# Altium schematic sheet MCU.SchDoc: =ProjectName
size A4; CheckedBy: DatNB; Author: Ven; CompanyName: Nacentech; Organization: IMET
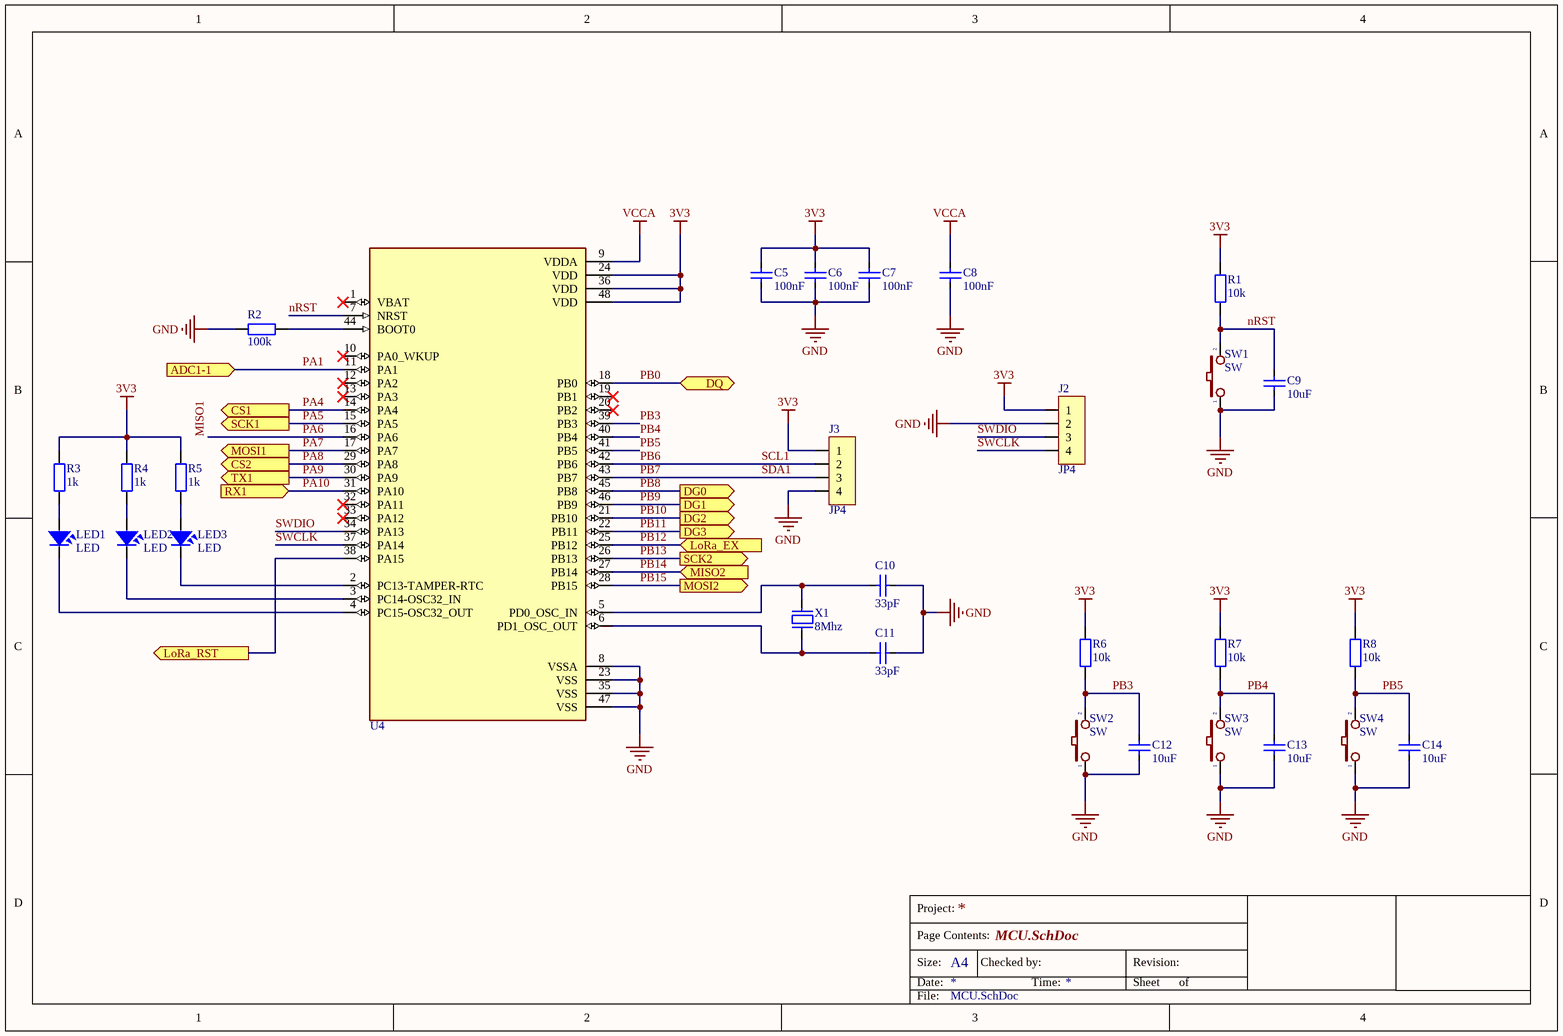
[diagram p0: MCU.SchDoc]

## Parts
C5  100nF  [CAP_0805]
C6  100nF  [CAP_0805]
C7  100nF  [CAP_0805]
C8  100nF  [CAP_0805]
C9  10uF  [CAP_0805]
C10  33pF  [CAP_0805]
C11  33pF  [CAP_0805]
C12  10uF  [CAP_0805]
C13  10uF  [CAP_0805]
C14  10uF  [CAP_0805]
J2  JP4  [JP4-C1T]
J3  JP4  [JP4-C1T]
LED1  LED  [LED-0805-Red]
LED2  LED  [LED-0805-Yellow]
LED3  LED  [LED-0805-Green]
R1  10k  [RES-SMD-0805]
R2  100k  [RES-SMD-0805]
R3  1k  [RES-SMD-0805]
R4  1k  [RES-SMD-0805]
R5  1k  [RES-SMD-0805]
R6  10k  [RES-SMD-0805]
R7  10k  [RES-SMD-0805]
R8  10k  [RES-SMD-0805]
SW1  SW  [SW 3x2x4]
SW2  SW  [SW2]
SW3  SW  [SW2]
SW4  SW  [SW2]
U4  STM32  [LQFP 48]  (value not drawn)
X1  8Mhz  [XTAL 5032 SMD]

## Ports
ADC1-1 (in), CS1 (out), CS2 (out), DG0 (out), DG1 (out), DG2 (out), DG3 (out), DQ (bidir), LoRa_EX (in), LoRa_RST (out), MISO2 (in), MOSI1 (out), MOSI2 (out), RX1 (in), SCK1 (out), SCK2 (out), TX1 (out)

## Nets
3V3: C5.2 C6.2 C7.2 J2.1 J3.1 R1.1 R3.1 R4.1 R5.1 R6.1 R7.1 R8.1 U4.24(VDD) U4.36(VDD) U4.48(VDD)
GND: C5.1 C6.1 C7.1 C8.1 C9.1 C10.2 C11.2 C12.1 C13.1 C14.1 J2.2 J3.4 R2.1 SW1.1 SW2.1 SW3.1 SW4.1 U4.8(VSSA) U4.23(VSS) U4.35(VSS) U4.47(VSS)
VCCA: C8.2 U4.9(VDDA)
LoRa_RST: U4.38(PA15) ; port LoRa_RST
MISO1: U4.16(PA6)  [also labelled PA6]
nRST: C9.2 R1.2 SW1.2 U4.7(NRST)
PA1: U4.11(PA1) ; port ADC1-1
PA4: U4.14(PA4) ; port CS1
PA5: U4.15(PA5) ; port SCK1
PA7: U4.17(PA7) ; port MOSI1
PA8: U4.29(PA8) ; port CS2
PA9: U4.30(PA9) ; port TX1
PA10: U4.31(PA10) ; port RX1
PB0: U4.18(PB0) ; port DQ
PB3: C12.2 R6.2 SW2.2 U4.39(PB3)
PB4: C13.2 R7.2 SW3.2 U4.40(PB4)
PB5: C14.2 R8.2 SW4.2 U4.41(PB5)
PB6: J3.2 U4.42(PB6)  [also labelled SCL1]
PB7: J3.3 U4.43(PB7)  [also labelled SDA1]
PB8: U4.45(PB8) ; port DG0
PB9: U4.46(PB9) ; port DG1
PB10: U4.21(PB10) ; port DG2
PB11: U4.22(PB11) ; port DG3
PB12: U4.25(PB12) ; port LoRa_EX
PB13: U4.26(PB13) ; port SCK2
PB14: U4.27(PB14) ; port MISO2
PB15: U4.28(PB15) ; port MOSI2
SWCLK: J2.4 U4.37(PA14)
SWDIO: J2.3 U4.34(PA13)
NetC10_1: C10.1 U4.5(PD0_OSC_IN) X1.2
NetC11_1: C11.1 U4.6(PD1_OSC_OUT) X1.1
NetLED1_1: LED1.1 R3.2
NetLED1_2: LED1.2 U4.4(PC15-OSC32_OUT)
NetLED2_1: LED2.1 R4.2
NetLED2_2: LED2.2 U4.3(PC14-OSC32_IN)
NetLED3_1: LED3.1 R5.2
NetLED3_2: LED3.2 U4.2(PC13-TAMPER-RTC)
NetR2_2: R2.2 U4.44(BOOT0)

Not connected (* = marked no-connect by the designer): U4 1(VBAT)* 10(PA0_WKUP)* 12(PA2)* 13(PA3)* 19(PB1)* 20(PB2)* 32(PA11)* 33(PA12)*

## Notes on the sheet
- Project:
- Page Contents:
- Size:
- Date:
- A4
- Checked by:
- Time:
- Revision:
- Sheet
- of
- File:

## Library data of the parts
C5-C14 = CapSMD: Capacitor; Value: 33p; Published: 8-Jun-2000; LatestRevisionDate: 17-Jul-2002; LatestRevisionNote: Re-released for DXP Platform.; PackageReference: RAD-0.3; Publisher: Altium Limited
J2 J3 = JP4: WR-PHD 2.54 mm Angled Socket Header; Manufacturer: W¨¹rth Elektronik eiSos GmbH; partNo: 613004143121; ComponentLink1 Description: Manufacturer; ComponentLink2 Description: Datasheet; NoPins: 04; Created Date: 29 March 2013; ComponentLink1URL: http://www.we-online.com; ComponentLink2URL: http://katalog.we-online.de/em/datasheet/6130xx143121.pdf; Created by: Karrer Zheng
LED1-LED3 = LED: LED Single colour Green and Red; Value: LED 3 ly Single Colour
R1-R8 = Resistor - SMD: Resistor SMD; Manufacturer: Generic Components; Class: Passive; Published: 08/06/2000; Publisher: Altium Hobart Technology Centre
SW1-SW4 = SW2: Switch button 2 pin; Value: SW chip 2 pin
U4 = STM32F103C8T6: STM32 ARM-based 32-bit MCU with 64 Kbytes Flash, 64-pin LQFP, Industrial Temperature
X1 = XT2: Crystal For all Crystal 2pin.; Value: 4Mhz